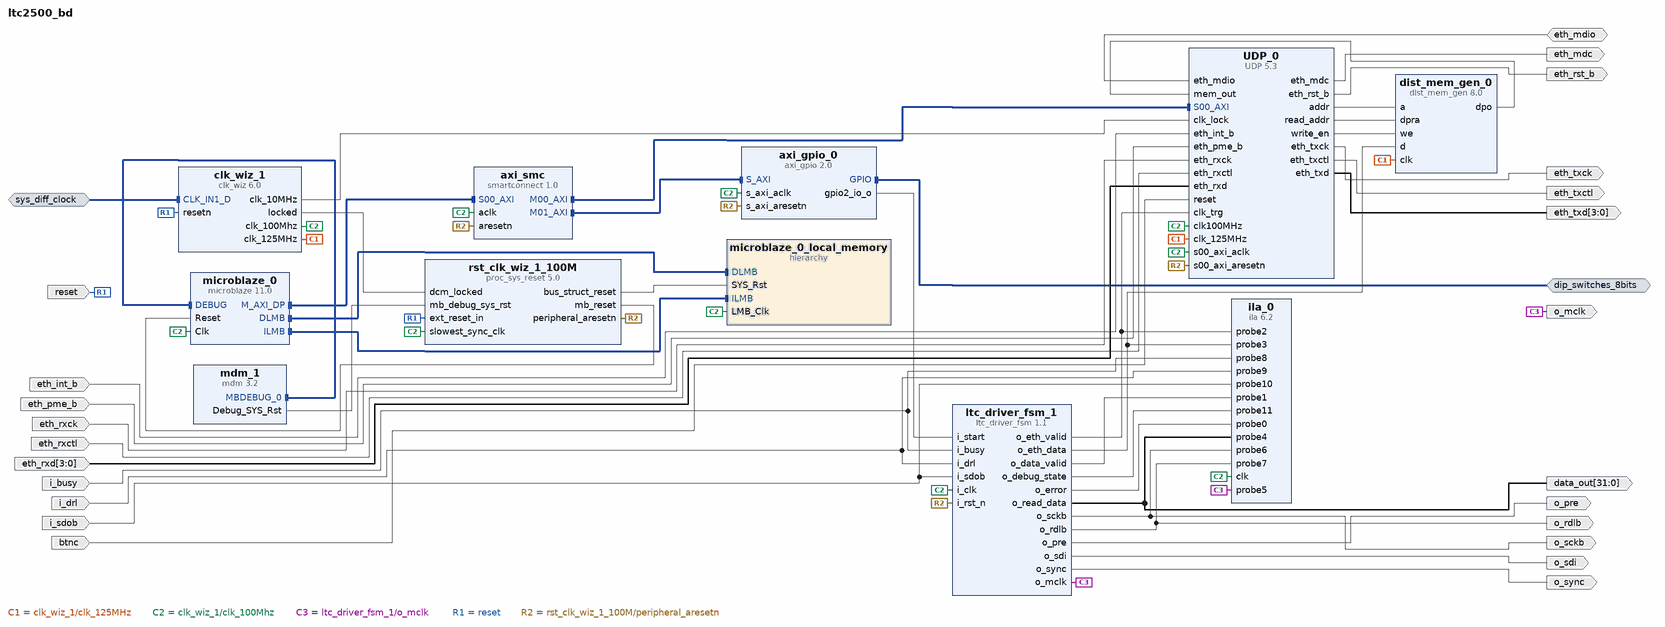
[diagram p0: block diagram of the top level]
# Vivado block design ltc2500_bd, xc7k325tffg900-2, Vivado 2025.2
create_bd_design ltc2500_bd

create_bd_intf_port -mode Slave -vlnv xilinx.com:interface:diff_clock_rtl:1.0 sys_diff_clock
set_property -dict {CONFIG.FREQ_HZ 200000000} [get_bd_intf_ports sys_diff_clock]
create_bd_intf_port -mode Master -vlnv xilinx.com:interface:gpio_rtl:1.0 dip_switches_8bits
create_bd_port -dir I -type rst reset
set_property -dict {CONFIG.POLARITY ACTIVE_LOW} [get_bd_ports reset]
create_bd_port -dir O eth_rst_b
create_bd_port -dir O eth_mdc
create_bd_port -dir IO eth_mdio
create_bd_port -dir O eth_txck
create_bd_port -dir O eth_txctl
create_bd_port -dir O -from 3 -to 0 eth_txd
create_bd_port -dir O o_mclk
create_bd_port -dir O o_sync
create_bd_port -dir O o_pre
create_bd_port -dir O o_sdi
create_bd_port -dir I i_drl
create_bd_port -dir I i_busy
create_bd_port -dir I eth_int_b
create_bd_port -dir I eth_pme_b
create_bd_port -dir I eth_rxck
create_bd_port -dir I eth_rxctl
create_bd_port -dir I -from 3 -to 0 eth_rxd
create_bd_port -dir I -type rst btnc
create_bd_port -dir O -from 31 -to 0 data_out
create_bd_port -dir I i_sdob
create_bd_port -dir O o_rdlb
create_bd_port -dir O o_sckb

create_bd_cell -type ip -vlnv xilinx.com:ip:microblaze:11.0 microblaze_0
set_property -dict [list \
  CONFIG.C_DEBUG_ENABLED 1 \
  CONFIG.C_D_AXI 1 \
  CONFIG.C_D_LMB 1 \
  CONFIG.C_ENABLE_CONVERSION 0 \
  CONFIG.C_I_LMB 1 \
] [get_bd_cells microblaze_0]
create_bd_cell -type ip -vlnv xilinx.com:user:UDP:5.3 UDP_0
create_bd_cell -type hier microblaze_0_local_memory
create_bd_cell -type ip -vlnv xilinx.com:ip:mdm:3.2 mdm_1
create_bd_cell -type ip -vlnv xilinx.com:ip:clk_wiz:6.0 clk_wiz_1
set_property -dict [list \
  CONFIG.CLKOUT2_JITTER 107.523 \
  CONFIG.CLKOUT2_PHASE_ERROR 89.971 \
  CONFIG.CLKOUT2_USED true \
  CONFIG.CLKOUT3_JITTER 178.053 \
  CONFIG.CLKOUT3_PHASE_ERROR 89.971 \
  CONFIG.CLKOUT3_USED true \
  CONFIG.CLK_OUT1_PORT clk_100Mhz \
  CONFIG.MMCM_CLKOUT1_DIVIDE 8 \
  CONFIG.MMCM_CLKOUT2_DIVIDE 100 \
  CONFIG.NUM_OUT_CLKS 3 \
  CONFIG.PRIM_SOURCE Differential_clock_capable_pin \
  CONFIG.RESET_PORT resetn \
  CONFIG.RESET_TYPE ACTIVE_LOW \
] [get_bd_cells clk_wiz_1]
create_bd_cell -type ip -vlnv xilinx.com:ip:proc_sys_reset:5.0 rst_clk_wiz_1_100M
create_bd_cell -type ip -vlnv xilinx.com:ip:smartconnect:1.0 axi_smc
set_property -dict {CONFIG.NUM_MI 2 CONFIG.NUM_SI 1} [get_bd_cells axi_smc]
create_bd_cell -type ip -vlnv xilinx.com:ip:dist_mem_gen:8.0 dist_mem_gen_0
set_property -dict {CONFIG.data_width 8 CONFIG.depth 8192 CONFIG.memory_type simple_dual_port_ram} [get_bd_cells dist_mem_gen_0]
create_bd_cell -type ip -vlnv xilinx.com:ip:ila:6.2 ila_0
set_property -dict [list \
  CONFIG.C_DATA_DEPTH 16384 \
  CONFIG.C_MONITOR_TYPE Native \
  CONFIG.C_NUM_OF_PROBES 12 \
  CONFIG.C_PROBE11_WIDTH 4 \
  CONFIG.C_PROBE3_WIDTH 8 \
  CONFIG.C_PROBE4_WIDTH 32 \
] [get_bd_cells ila_0]
create_bd_cell -type ip -vlnv xilinx.com:ip:axi_gpio:2.0 axi_gpio_0
set_property -dict [list \
  CONFIG.C_ALL_INPUTS 1 \
  CONFIG.C_ALL_INPUTS_2 0 \
  CONFIG.C_ALL_OUTPUTS_2 1 \
  CONFIG.C_GPIO2_WIDTH 1 \
  CONFIG.C_GPIO_WIDTH 8 \
  CONFIG.C_IS_DUAL 1 \
  CONFIG.GPIO2_BOARD_INTERFACE Custom \
  CONFIG.GPIO_BOARD_INTERFACE Custom \
  CONFIG.USE_BOARD_FLOW true \
] [get_bd_cells axi_gpio_0]
create_bd_cell -type ip -vlnv xilinx.com:user:ltc_driver_fsm:1.1 ltc_driver_fsm_1
set_property -dict {CONFIG.DF 64} [get_bd_cells ltc_driver_fsm_1]

# ---- hierarchy /microblaze_0_local_memory ----
current_bd_instance /microblaze_0_local_memory
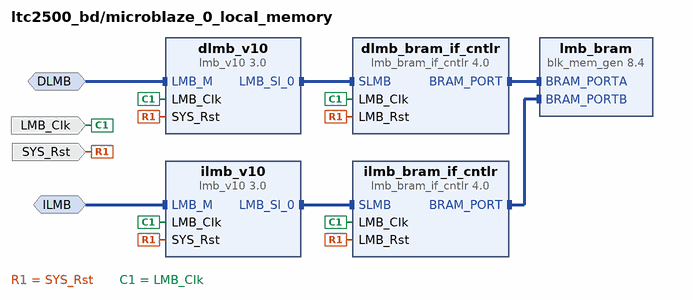
[diagram p1: block diagram inside /microblaze_0_local_memory]
create_bd_intf_pin -mode MirroredMaster -vlnv xilinx.com:interface:lmb_rtl:1.0 DLMB
create_bd_intf_pin -mode MirroredMaster -vlnv xilinx.com:interface:lmb_rtl:1.0 ILMB
create_bd_pin -dir I -type clk LMB_Clk
create_bd_pin -dir I -type rst SYS_Rst

create_bd_cell -type ip -vlnv xilinx.com:ip:lmb_v10:3.0 dlmb_v10
create_bd_cell -type ip -vlnv xilinx.com:ip:lmb_v10:3.0 ilmb_v10
create_bd_cell -type ip -vlnv xilinx.com:ip:lmb_bram_if_cntlr:4.0 dlmb_bram_if_cntlr
set_property -dict {CONFIG.C_ECC 0} [get_bd_cells dlmb_bram_if_cntlr]
create_bd_cell -type ip -vlnv xilinx.com:ip:lmb_bram_if_cntlr:4.0 ilmb_bram_if_cntlr
set_property -dict {CONFIG.C_ECC 0} [get_bd_cells ilmb_bram_if_cntlr]
create_bd_cell -type ip -vlnv xilinx.com:ip:blk_mem_gen:8.4 lmb_bram
set_property -dict {CONFIG.Memory_Type True_Dual_Port_RAM CONFIG.use_bram_block BRAM_Controller} [get_bd_cells lmb_bram]

# ---- connections ----

current_bd_instance /microblaze_0_local_memory
connect_bd_intf_net -intf_net microblaze_0_dlmb [get_bd_intf_pins dlmb_v10/LMB_M] [get_bd_intf_pins DLMB]
connect_bd_intf_net -intf_net microblaze_0_dlmb_bus [get_bd_intf_pins dlmb_v10/LMB_Sl_0] [get_bd_intf_pins dlmb_bram_if_cntlr/SLMB]
connect_bd_intf_net -intf_net microblaze_0_dlmb_cntlr [get_bd_intf_pins dlmb_bram_if_cntlr/BRAM_PORT] [get_bd_intf_pins lmb_bram/BRAM_PORTA]
connect_bd_intf_net -intf_net microblaze_0_ilmb [get_bd_intf_pins ilmb_v10/LMB_M] [get_bd_intf_pins ILMB]
connect_bd_intf_net -intf_net microblaze_0_ilmb_bus [get_bd_intf_pins ilmb_v10/LMB_Sl_0] [get_bd_intf_pins ilmb_bram_if_cntlr/SLMB]
connect_bd_intf_net -intf_net microblaze_0_ilmb_cntlr [get_bd_intf_pins ilmb_bram_if_cntlr/BRAM_PORT] [get_bd_intf_pins lmb_bram/BRAM_PORTB]
connect_bd_net [get_bd_pins SYS_Rst] \
  [get_bd_pins dlmb_v10/SYS_Rst] [get_bd_pins dlmb_bram_if_cntlr/LMB_Rst] [get_bd_pins ilmb_v10/SYS_Rst] \
  [get_bd_pins ilmb_bram_if_cntlr/LMB_Rst]
connect_bd_net -net microblaze_0_Clk [get_bd_pins LMB_Clk] \
  [get_bd_pins dlmb_v10/LMB_Clk] [get_bd_pins dlmb_bram_if_cntlr/LMB_Clk] [get_bd_pins ilmb_v10/LMB_Clk] \
  [get_bd_pins ilmb_bram_if_cntlr/LMB_Clk]
set_property HDL_ATTRIBUTE.BMM_INFO_ADDRESS_SPACE {byte  0x00000000 32 > ltc2500_bd microblaze_0_local_memory/lmb_bram} [get_bd_cells dlmb_bram_if_cntlr]
set_property HDL_ATTRIBUTE.KEEP_HIERARCHY yes [get_bd_cells dlmb_bram_if_cntlr]

current_bd_instance /
connect_bd_intf_net [get_bd_intf_ports dip_switches_8bits] [get_bd_intf_pins axi_gpio_0/GPIO]
connect_bd_intf_net [get_bd_intf_pins axi_smc/M00_AXI] [get_bd_intf_pins UDP_0/S00_AXI]
connect_bd_intf_net [get_bd_intf_pins axi_smc/M01_AXI] [get_bd_intf_pins axi_gpio_0/S_AXI]
connect_bd_intf_net [get_bd_intf_pins microblaze_0/M_AXI_DP] [get_bd_intf_pins axi_smc/S00_AXI]
connect_bd_intf_net [get_bd_intf_pins mdm_1/MBDEBUG_0] [get_bd_intf_pins microblaze_0/DEBUG]
connect_bd_intf_net [get_bd_intf_pins microblaze_0/DLMB] [get_bd_intf_pins microblaze_0_local_memory/DLMB]
connect_bd_intf_net [get_bd_intf_pins microblaze_0/ILMB] [get_bd_intf_pins microblaze_0_local_memory/ILMB]
connect_bd_intf_net [get_bd_intf_ports sys_diff_clock] [get_bd_intf_pins clk_wiz_1/CLK_IN1_D]
connect_bd_net [get_bd_ports eth_mdio] [get_bd_pins UDP_0/eth_mdio]
connect_bd_net [get_bd_pins UDP_0/addr] [get_bd_pins dist_mem_gen_0/a]
connect_bd_net [get_bd_pins UDP_0/eth_mdc] [get_bd_ports eth_mdc]
connect_bd_net [get_bd_pins UDP_0/eth_rst_b] [get_bd_ports eth_rst_b]
connect_bd_net [get_bd_pins UDP_0/eth_txck] [get_bd_ports eth_txck]
connect_bd_net [get_bd_pins UDP_0/eth_txd] [get_bd_ports eth_txd]
connect_bd_net [get_bd_pins UDP_0/read_addr] [get_bd_pins dist_mem_gen_0/dpra]
connect_bd_net [get_bd_pins UDP_0/write_en] [get_bd_pins dist_mem_gen_0/we]
connect_bd_net [get_bd_pins axi_gpio_0/gpio2_io_o] [get_bd_pins ltc_driver_fsm_1/i_start]
connect_bd_net [get_bd_pins clk_wiz_1/clk_10MHz] [get_bd_pins UDP_0/clk_lock]
connect_bd_net [get_bd_pins clk_wiz_1/clk_125MHz] [get_bd_pins UDP_0/clk_125MHz] [get_bd_pins dist_mem_gen_0/clk]
connect_bd_net -net clk_wiz_1_clk_400MHz [get_bd_pins clk_wiz_1/clk_100Mhz] \
  [get_bd_pins microblaze_0/Clk] [get_bd_pins axi_smc/aclk] [get_bd_pins microblaze_0_local_memory/LMB_Clk] \
  [get_bd_pins UDP_0/s00_axi_aclk] [get_bd_pins UDP_0/clk100MHz] [get_bd_pins ila_0/clk] [get_bd_pins axi_gpio_0/s_axi_aclk] \
  [get_bd_pins rst_clk_wiz_1_100M/slowest_sync_clk] [get_bd_pins ltc_driver_fsm_1/i_clk]
connect_bd_net [get_bd_pins clk_wiz_1/locked] [get_bd_pins rst_clk_wiz_1_100M/dcm_locked]
connect_bd_net [get_bd_pins dist_mem_gen_0/dpo] [get_bd_pins UDP_0/mem_out]
connect_bd_net -net eth_int_b_0_1 [get_bd_ports eth_int_b] [get_bd_pins UDP_0/eth_int_b]
connect_bd_net [get_bd_ports eth_pme_b] [get_bd_pins UDP_0/eth_pme_b]
connect_bd_net -net eth_rxck_0_1 [get_bd_ports eth_rxck] [get_bd_pins UDP_0/eth_rxck]
connect_bd_net -net eth_rxctl_0_1 [get_bd_ports eth_rxctl] [get_bd_pins UDP_0/eth_rxctl]
connect_bd_net -net eth_rxd_0_1 [get_bd_ports eth_rxd] [get_bd_pins UDP_0/eth_rxd]
connect_bd_net -net eth_txctl [get_bd_pins UDP_0/eth_txctl] [get_bd_ports eth_txctl]
connect_bd_net [get_bd_ports i_busy] [get_bd_pins ila_0/probe8] [get_bd_pins ltc_driver_fsm_1/i_busy]
connect_bd_net [get_bd_ports i_drl] [get_bd_pins ila_0/probe9] [get_bd_pins ltc_driver_fsm_1/i_drl]
connect_bd_net -net i_sdoa_1 [get_bd_ports i_sdob] [get_bd_pins ila_0/probe10] [get_bd_pins ltc_driver_fsm_1/i_sdob]
connect_bd_net -net ltc_driver_eth_0_o_eth_data [get_bd_pins ltc_driver_fsm_1/o_eth_data] [get_bd_pins dist_mem_gen_0/d] [get_bd_pins ila_0/probe3]
connect_bd_net -net ltc_driver_eth_0_o_eth_valid [get_bd_pins ltc_driver_fsm_1/o_eth_valid] [get_bd_pins ila_0/probe2] [get_bd_pins UDP_0/clk_trg]
connect_bd_net -net ltc_driver_fsm_0_o_mclk [get_bd_pins ltc_driver_fsm_1/o_mclk] [get_bd_ports o_mclk] [get_bd_pins ila_0/probe5]
connect_bd_net -net ltc_driver_fsm_0_o_read_data [get_bd_pins ltc_driver_fsm_1/o_read_data] [get_bd_pins ila_0/probe4] [get_bd_ports data_out]
connect_bd_net -net ltc_driver_fsm_0_o_scka [get_bd_pins ltc_driver_fsm_1/o_sckb] [get_bd_pins ila_0/probe6] [get_bd_ports o_sckb]
connect_bd_net [get_bd_pins ltc_driver_fsm_1/o_data_valid] [get_bd_pins ila_0/probe1]
connect_bd_net [get_bd_pins ltc_driver_fsm_1/o_debug_state] [get_bd_pins ila_0/probe11]
connect_bd_net [get_bd_pins ltc_driver_fsm_1/o_error] [get_bd_pins ila_0/probe0]
connect_bd_net [get_bd_pins ltc_driver_fsm_1/o_pre] [get_bd_ports o_pre]
connect_bd_net [get_bd_pins ltc_driver_fsm_1/o_rdlb] [get_bd_pins ila_0/probe7] [get_bd_ports o_rdlb]
connect_bd_net [get_bd_pins ltc_driver_fsm_1/o_sdi] [get_bd_ports o_sdi]
connect_bd_net [get_bd_pins ltc_driver_fsm_1/o_sync] [get_bd_ports o_sync]
connect_bd_net [get_bd_pins mdm_1/Debug_SYS_Rst] [get_bd_pins rst_clk_wiz_1_100M/mb_debug_sys_rst]
connect_bd_net -net reset_0_1 [get_bd_ports btnc] [get_bd_pins UDP_0/reset]
connect_bd_net [get_bd_ports reset] [get_bd_pins rst_clk_wiz_1_100M/ext_reset_in] [get_bd_pins clk_wiz_1/resetn]
connect_bd_net [get_bd_pins rst_clk_wiz_1_100M/bus_struct_reset] [get_bd_pins microblaze_0_local_memory/SYS_Rst]
connect_bd_net [get_bd_pins rst_clk_wiz_1_100M/mb_reset] [get_bd_pins microblaze_0/Reset]
connect_bd_net [get_bd_pins rst_clk_wiz_1_100M/peripheral_aresetn] \
  [get_bd_pins axi_smc/aresetn] [get_bd_pins UDP_0/s00_axi_aresetn] [get_bd_pins axi_gpio_0/s_axi_aresetn] \
  [get_bd_pins ltc_driver_fsm_1/i_rst_n]
set_property HDL_ATTRIBUTE.BMM_INFO_PROCESSOR {microblaze-le > ltc2500_bd microblaze_0_local_memory/dlmb_bram_if_cntlr} [get_bd_cells microblaze_0]
set_property HDL_ATTRIBUTE.KEEP_HIERARCHY yes [get_bd_cells microblaze_0]

# ---- address map ----
assign_bd_address -offset 0x00000000 -range 16K -target_address_space [get_bd_addr_spaces microblaze_0/Data] [get_bd_addr_segs microblaze_0_local_memory/dlmb_bram_if_cntlr/SLMB/Mem]
assign_bd_address -offset 0x40000000 -range 64K -target_address_space [get_bd_addr_spaces microblaze_0/Data] [get_bd_addr_segs axi_gpio_0/S_AXI/Reg]
assign_bd_address -offset 0x44A00000 -range 64K -target_address_space [get_bd_addr_spaces microblaze_0/Data] [get_bd_addr_segs UDP_0/S00_AXI/S00_AXI_reg]
assign_bd_address -offset 0x00000000 -range 16K -target_address_space [get_bd_addr_spaces microblaze_0/Instruction] [get_bd_addr_segs microblaze_0_local_memory/ilmb_bram_if_cntlr/SLMB/Mem]

validate_bd_design
save_bd_design
